# EAGLE design Dashboard rev4 (EAGLE 8.1.0)
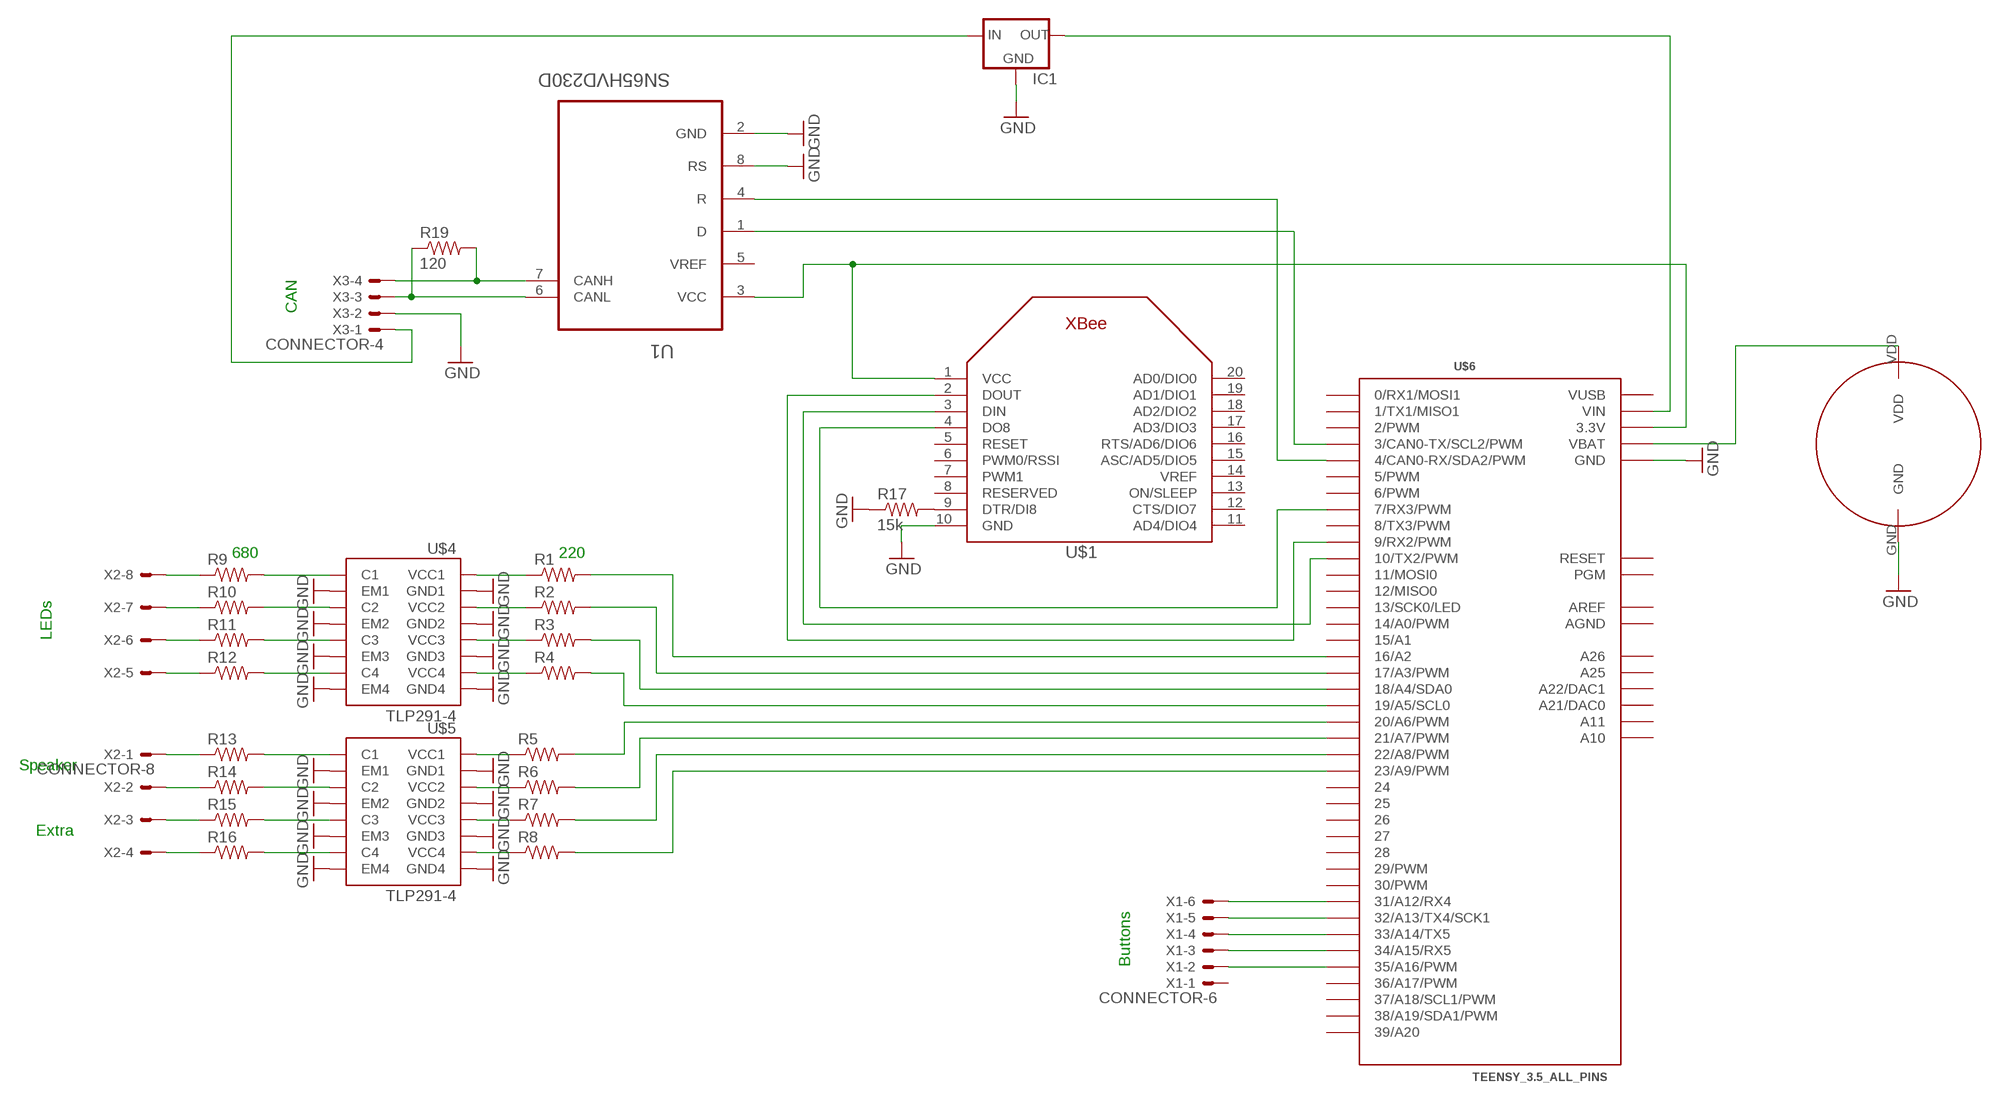
[diagram p0: schematic, sheet 1]

## Parts
IC1  5VREG_L7805SPACED  [TO-220-SPACED]
R1  RESISTORAXIAL-0.3  [AXIAL-0.3]
R2  RESISTORAXIAL-0.3  [AXIAL-0.3]
R3  RESISTORAXIAL-0.3  [AXIAL-0.3]
R4  RESISTORAXIAL-0.3  [AXIAL-0.3]
R5  RESISTORAXIAL-0.3  [AXIAL-0.3]
R6  RESISTORAXIAL-0.3  [AXIAL-0.3]
R7  RESISTORAXIAL-0.3  [AXIAL-0.3]
R8  RESISTORAXIAL-0.3  [AXIAL-0.3]
R9  RESISTORAXIAL-0.3  [AXIAL-0.3]
R10  RESISTORAXIAL-0.3  [AXIAL-0.3]
R11  RESISTORAXIAL-0.3  [AXIAL-0.3]
R12  RESISTORAXIAL-0.3  [AXIAL-0.3]
R13  RESISTORAXIAL-0.3  [AXIAL-0.3]
R14  RESISTORAXIAL-0.3  [AXIAL-0.3]
R15  RESISTORAXIAL-0.3  [AXIAL-0.3]
R16  RESISTORAXIAL-0.3  [AXIAL-0.3]
R17  15k  RESISTORAXIAL-0.3  [AXIAL-0.3]
R19  120  RESISTORAXIAL-0.3  [AXIAL-0.3]
U1  SN65HVD230D  [SOIC127P600X175-8N]
U$1  XBEE  [XBEE]
U$2  COIN-CELL-HOLDER  [COIN-CELL-HOLDER]
U$4  TLP291-4  [SOIC-16]
U$5  TLP291-4  [SOIC-16]
U$6  TEENSY_3.5_ALL_PINS  [TEENSY_3.5_ALL_PINS]
X1  CONNECTOR-6  [MINIFIT_5566-6]
X2  CONNECTOR-8  [MINIFIT_5566-8]
X3  CONNECTOR-4  [MINIFIT_5566-4]

## Nets
GND: IC1.2(GND) R17.P$1 U1.2(GND) U1.8(RS) U$1.10(GND) U$2.GND U$4.2(GND1) U$4.4(GND2) U$4.6(GND3) U$4.8(GND4) U$4.9(EM4) U$4.11(EM3) U$4.13(EM2) U$4.15(EM1) U$5.2(GND1) U$5.4(GND2) U$5.6(GND3) U$5.8(GND4) U$5.9(EM4) U$5.11(EM3) U$5.13(EM2) U$5.15(EM1) U$6.GND U$6.GND1(GND) U$6.GND3(GND) U$6.GND4(GND) U$6.GND6(GND) X3.2
N$1: R9.P$1 X2.8
N$2: U$1.2(DOUT) U$6.9(9/RX2/PWM)
N$3: R10.P$1 X2.7
N$4: R11.P$1 X2.6
N$5: R1.P$1 U$4.1(VCC1)
N$6: R12.P$1 X2.5
N$7: R2.P$1 U$4.3(VCC2)
N$8: R3.P$1 U$4.5(VCC3)
N$9: U$1.3(DIN) U$6.10(10/TX2/PWM)
N$10: U$1.4(DO8) U$6.7(7/RX3/PWM)
N$11: R4.P$1 U$4.7(VCC4)
N$12: R5.P$1 U$5.1(VCC1)
N$13: R17.P$2 U$1.9(DTR/DI8)
N$14: R6.P$1 U$5.3(VCC2)
N$15: R7.P$1 U$5.5(VCC3)
N$16: R8.P$1 U$5.7(VCC4)
N$17: U$6.31/A12(31/A12/RX4) X1.6
N$18: R13.P$1 X2.1
N$19: U$6.32/A13(32/A13/TX4/SCK1) X1.5
N$20: U$6.33/A14(33/A14/TX5) X1.4
N$21: U$6.34/A15(34/A15/RX5) X1.3
N$22: U$6.35/A16(35/A16/PWM) X1.2
N$23: U$2.VDD U$6.VBAT
N$24: U1.1(D) U$6.3(3/CAN0-TX/SCL2/PWM)
N$25: R9.P$2 U$4.16(C1)
N$26: R10.P$2 U$4.14(C2)
N$27: R11.P$2 U$4.12(C3)
N$28: R12.P$2 U$4.10(C4)
N$29: R13.P$2 U$5.16(C1)
N$30: R14.P$2 U$5.14(C2)
N$31: R15.P$2 U$5.12(C3)
N$32: R16.P$2 U$5.10(C4)
N$33: R14.P$1 X2.2
N$34: R15.P$1 X2.3
N$35: R16.P$1 X2.4
N$36: U1.4(R) U$6.4(4/CAN0-RX/SDA2/PWM)
N$37: R19.P$2 U1.7(CANH) X3.4
N$38: R1.P$2 U$6.16/A2
N$39: R2.P$2 U$6.17/A3(17/A3/PWM)
N$40: R3.P$2 U$6.18/A4(18/A4/SDA0)
N$41: R19.P$1 U1.6(CANL) X3.3
N$42: IC1.3(OUT) U$6.VIN
N$43: IC1.1(IN) X3.1
N$48: R4.P$2 U$6.19/A5(19/A5/SCL0)
N$49: R5.P$2 U$6.20/A6(20/A6/PWM)
N$50: R6.P$2 U$6.21/A7(21/A7/PWM)
N$51: R7.P$2 U$6.22/A8(22/A8/PWM)
N$54: R8.P$2 U$6.23/A9(23/A9/PWM)
VCC: U1.3(VCC) U$1.1(VCC) U$6.3.3V U$6.3.3V3(3.3V) U$6.3.3V4(3.3V)
Unconnected: U1.5(VREF) U$1.5(RESET) U$1.6(PWM0/RSSI) U$1.7(PWM1) U$1.8(RESERVED) U$1.11(AD4/DIO4) U$1.12(CTS/DIO7) U$1.13(ON/SLEEP) U$1.14(VREF) U$1.15(ASC/AD5/DIO5) U$1.16(RTS/AD6/DIO6) U$1.17(AD3/DIO3) U$1.18(AD2/DIO2) U$1.19(AD1/DIO1) U$1.20(AD0/DIO0) U$6.0(0/RX1/MOSI1) U$6.1(1/TX1/MISO1) U$6.2(2/PWM) U$6.5(5/PWM) U$6.6(6/PWM) U$6.8(8/TX3/PWM) U$6.11(11/MOSI0) U$6.12(12/MISO0) U$6.13(13/SCK0/LED) U$6.14/A0(14/A0/PWM) U$6.15/A1 U$6.24 U$6.25 U$6.26 U$6.27 U$6.28 U$6.29(29/PWM) U$6.30(30/PWM) U$6.36/A17(36/A17/PWM) U$6.37/A18(37/A18/SCL1/PWM) U$6.38/A19(38/A19/SDA1/PWM) U$6.39/A20 U$6.A10 U$6.A11 U$6.A21(A21/DAC0) U$6.A22(A22/DAC1) U$6.A25 U$6.A26 U$6.PGM U$6.RESET X1.1

## Notes on the sheet
- CAN
- 680 | 220
- LEDs
- Speaker
- Extra
- Buttons

## Power pins joined to a net without a drawn wire
AGND: U$6.AGND
AREF: U$6.AREF
VUSB: U$6.VUSB

## Library data of the parts
IC1 = HyTechDevices2:5VREG_L7805: Voltage Regulator Switching 5v regulator Datasheet <http://power.murata.com/data/power/oki-78sr.pdf> Standard 7805 5V regulator. IGO (Input Ground Output). Spark Fun Electronics SKU : COM-00107 Datasheet <http://www.mouser.com/ds/2/308/MC7800-D-94905.pdf>
R1-R17 R19 = HyTechDevices:RESISTOR: Resistor Basic schematic elements and footprints for 0603, 1206, and PTH resistors.
U1 = Texas Instruments:SN65HVD230D: 3.3-V CAN TRANSCEIVERS; MPN: SN65HVD230D; OC_FARNELL: 1103105; OC_NEWARK: 75C7744; PACKAGE: SOIC-8; SUPPLIER: Texas Instruments
U$1 = HyTechDevices:XBEE: Source: Adafruit <https://github.com/adafruit/Adafruit-Eagle-Library>
U$2 = HyTechDevices2:COIN-CELL-HOLDER
U$4 U$5 = HyTechDevices:TLP291-4: Toshiba Quad Channel Optocoupler TLP291-4
U$6 = Teensy_3_and_LC_Series_Boards_v1.4:TEENSY_3.5_ALL_PINS: All PIN version of the Teensy 3.5. Note: the NC pin is not shown in symbol package, not connected here either.
X1 = HyTechDevices2:CONNECTOR-6: Mini-Fit Junior connector 6 pole Source: http://www.molex.com; MPN: 95566-61002; OC_FARNELL: unknown; OC_NEWARK: 22K8620
X2 = HyTechDevices2:CONNECTOR-8: Mini-Fit Junior connector 8 pole Source: http://www.molex.com; OC_FARNELL: unknown; OC_NEWARK: unknown
X3 = HyTechDevices2:CONNECTOR-4: Mini-Fit Junior connector 4 pole Source: http://www.molex.com; OC_FARNELL: unknown; OC_NEWARK: unknown

## Board
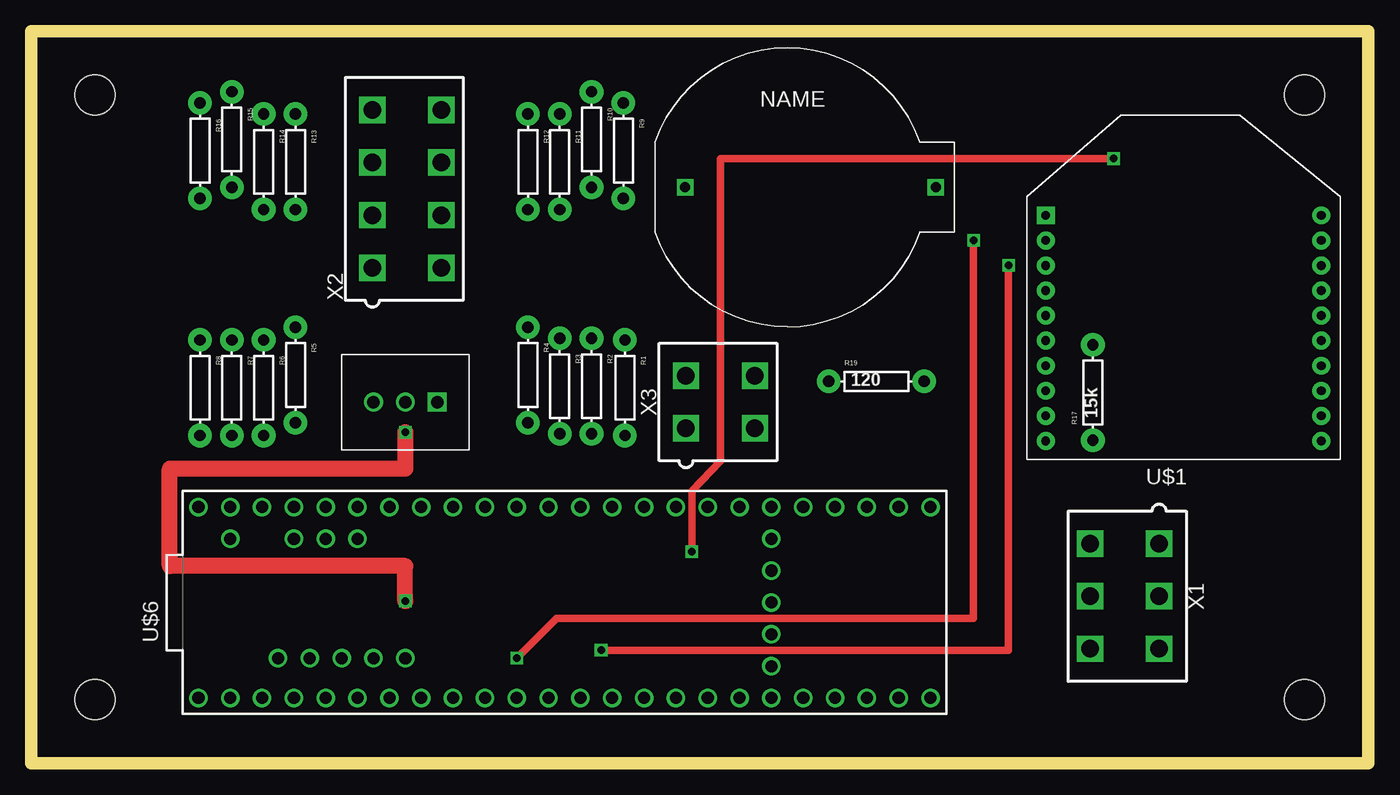
[diagram p1: board, top side]
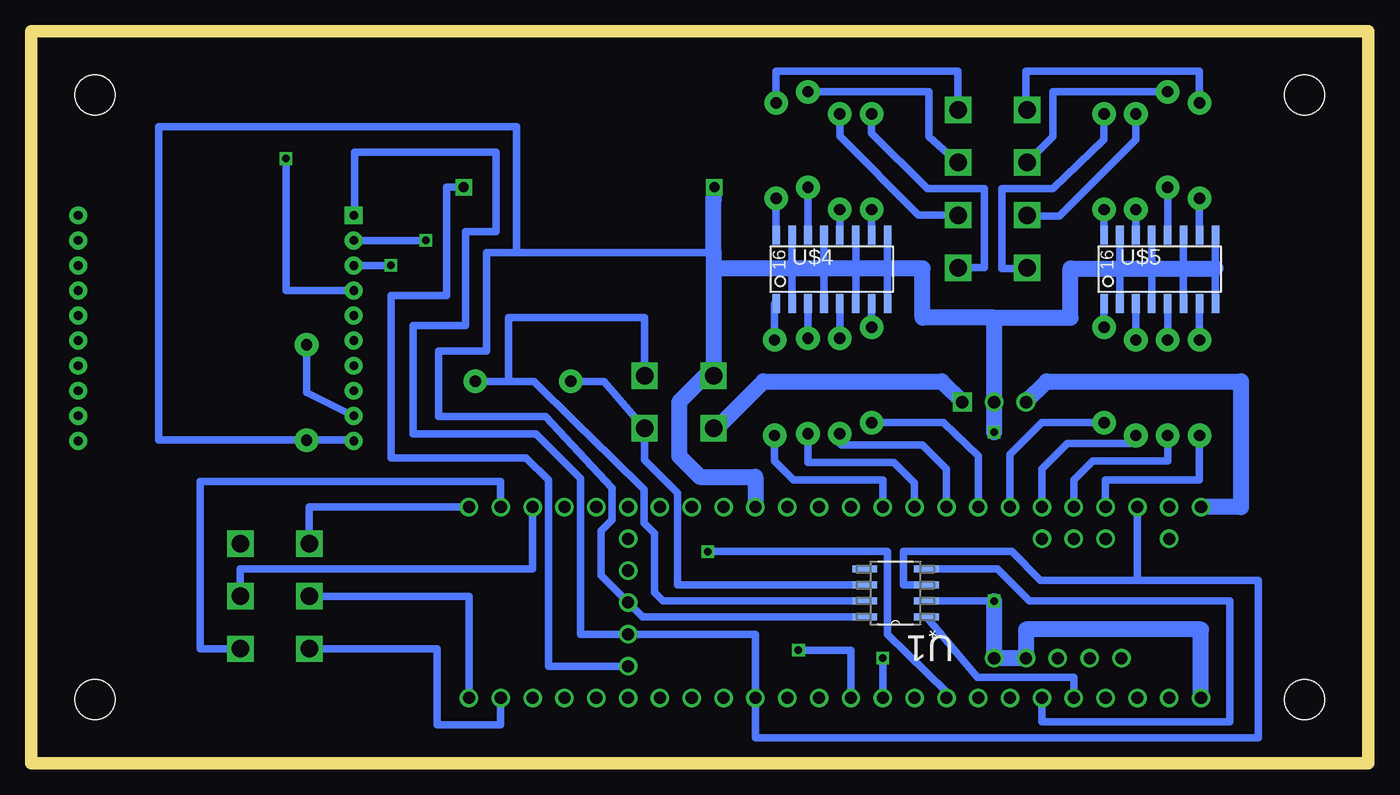
[diagram p2: board, bottom side, seen from below]

Size 106.68 x 58.42 mm. Coordinates in mm from the lower left corner, seen from the top.
Outline: 0,0 0,58.42 106.68,58.42 106.68,0 0,0
Copper layers (1*16): Top 0.035mm / dielectric 1.5mm / Bottom 0.035mm
Design rules "default *": minimum track width 10mil, minimum drill 24mil, track to track 16mil, track to pad 16mil, pad to pad 16mil, via to via 16mil, smd to smd 16mil, copper to edge 40mil, drill to drill 8mil, minimum pad ring 10mil, minimum via ring 8mil, stop-mask expansion 4mil, vias tented up to drill 0mil, thermal gap 10mil
Holes 3.2 mm at 5.08,53.34 5.08,5.08 101.6,5.08 101.6,53.34

### Footprints (pad centres in the part's own frame; a part is rotated, then mirrored left to right if it is on the bottom)
TO-220-SPACED = drill 1 square: 1 -2.54,0 | drill 1: 2 0,0; 3 2.54,0
AXIAL-0.3 = drill 0.9 pad 1.88: P$1 -3.81,0; P$2 3.81,0
SOIC127P600X175-8N = smd 1.981 x 0.559: 1 -2.464,1.905; 2 -2.464,0.635; 3 -2.464,-0.635; 4 -2.464,-1.905; 5 2.464,-1.905; 6 2.464,-0.635; 7 2.464,0.635; 8 2.464,1.905
XBEE = drill 0.7 pad 1.422 square: 1 -11,5.5 | drill 0.7 pad 1.422: 2 -11,3.5; 3 -11,1.5; 4 -11,-0.5; 5 -11,-2.5; 6 -11,-4.5; 7 -11,-6.5; 8 -11,-8.5; 9 -11,-10.5; 10 -11,-12.5; 11 11,-12.5; 12 11,-10.5; 13 11,-8.5; 14 11,-6.5; 15 11,-4.5; 16 11,-2.5; 17 11,-0.5; 18 11,1.5; 19 11,3.5; 20 11,5.5
COIN-CELL-HOLDER = drill 0.8 square: GND -8.15,0; VDD 11.85,0
SOIC-16 = smd 0.61 x 1.524: 1 -4.445,-2.794; 2 -3.175,-2.794; 3 -1.905,-2.794; 4 -0.635,-2.794; 5 0.635,-2.794; 6 1.905,-2.794; 7 3.175,-2.794; 8 4.445,-2.794; 9 4.445,2.667; 10 3.175,2.667; 11 1.905,2.667; 12 0.635,2.667; 13 -0.635,2.667; 14 -1.905,2.667; 15 -3.175,2.667; 16 -4.445,2.667
TEENSY_3.5_ALL_PINS = drill 0.965: 0 -7.62,27.94; 1 -7.62,25.4; 2 -7.62,22.86; 3 -7.62,20.32; 3.3V 7.62,25.4; 3.3V3 -7.62,-5.08; 3.3V4 -2.54,-15.24; 4 -7.62,17.78; 5 -7.62,15.24; 6 -7.62,12.7; 7 -7.62,10.16; 8 -7.62,7.62; 9 -7.62,5.08; 10 -7.62,2.54; 11 -7.62,0; 12 -7.62,-2.54; 13 7.62,-2.54; 14/A0 7.62,0; 15/A1 7.62,2.54; 16/A2 7.62,5.08; 17/A3 7.62,7.62; 18/A4 7.62,10.16; 19/A5 7.62,12.7; 20/A6 7.62,15.24; 21/A7 7.62,17.78; 22/A8 7.62,20.32; 23/A9 7.62,22.86; 24 -7.62,-7.62; 25 -7.62,-10.16; 26 -7.62,-12.7; 27 -7.62,-15.24; 28 -7.62,-17.78; 29 -7.62,-20.32; 30 -7.62,-22.86; 31/A12 -7.62,-25.4; 32/A13 -7.62,-27.94; 33/A14 7.62,-27.94; 34/A15 7.62,-25.4; 35/A16 7.62,-22.86; 36/A17 7.62,-20.32; 37/A18 7.62,-17.78; 38/A19 7.62,-15.24; 39/A20 7.62,-12.7; A10 5.08,20.32; A11 5.08,17.78; A21 7.62,-10.16; A22 7.62,-7.62; A25 -4.445,19.05; A26 -4.445,21.59; AGND 7.62,27.94; AREF 5.08,22.86; GND -7.62,30.48; GND1 7.62,-5.08; GND3 -4.445,16.51; GND4 -4.445,13.97; GND6 0,-15.24; NC -4.445,24.13; PGM 2.54,-15.24; RESET 5.08,-15.24; VBAT -5.08,-15.24; VIN 7.62,30.48; VUSB 5.08,27.94
MINIFIT_5566-6 = drill 1.4 square: 1 4.2,-2.75; 2 0,-2.75; 3 -4.2,-2.75; 4 4.2,2.75; 5 0,2.75; 6 -4.2,2.75
MINIFIT_5566-8 = drill 1.4 square: 1 6.3,-2.75; 2 2.1,-2.75; 3 -2.1,-2.75; 4 -6.3,-2.75; 5 6.3,2.75; 6 2.1,2.75; 7 -2.1,2.75; 8 -6.3,2.75
MINIFIT_5566-4 = drill 1.4 square: 1 2.1,-2.75; 2 -2.1,-2.75; 3 2.1,2.75; 4 -2.1,2.75

### Placement (x,y rotation side)
IC1  29.84,28.83 180 top
R1  47.37,29.97 270 top
R2  44.7,30.1 270 top
R3  42.16,30.1 270 top
R4  39.62,30.99 270 top
R5  21.08,30.99 270 top
R6  18.54,29.97 270 top
R7  16,29.97 270 top
R8  13.46,29.97 270 top
R9  47.24,48.9 270 top
R10  44.7,49.78 270 top
R11  42.16,48.01 270 top
R12  39.62,48.01 270 top
R13  21.08,48.01 270 top
R14  18.54,48.01 270 top
R15  16,49.78 270 top
R16  13.46,48.9 270 top
R17  84.71,29.59 90 top
R19  67.44,30.48 0 top
U1  37.72,13.59 180 bottom
U$1  91.95,38.23 0 top
U$2  60.33,45.97 0 top
U$4  42.8,39.5 0 bottom
U$5  16.64,39.5 0 bottom
U$6  43.81,12.83 90 top
X1  87.25,13.34 90 top
X2  29.97,45.85 270 top
X3  54.99,28.83 270 top

### Tracks (layer width: path | path; a pad name or v marks a point on that pad's centre or on a via)
GND  (via drill 0.6)
  Top 1.27: v29.84,26.42 29.84,23.5 11.05,23.5 11.05,15.75 29.84,15.75 v29.84,12.95
  Bottom 0.61: U$5.8 12.19,39.5 U$5.9 | U$5.11 14.73,39.5 U$5.6 | U$5.13 17.27,39.5 U$5.4 | U$5.15 19.81,39.5 U$5.2 | U$4.2 45.97,39.5 U$4.15 | U$4.6 40.89,39.5 U$4.11 | U$4.4 43.43,39.5 U$4.13 | U$1.10 80.95,25.78 R17.P$1 96.52,25.78 96.52,50.8 67.94,50.8 67.94,40.77 | v29.84,12.95 U1.2 | U$4.9 38.35,39.5 U$4.8 | U1.8 57.91,11.68 U$6.GND6 61.21,14.99 61.21,18.54 60.33,19.43 60.33,21.97 65.66,27.69 74.17,27.69 74.17,32.89 70.36,32.89 70.36,40.77 67.94,40.77 | 67.94,40.77 52.24,40.77
  Bottom 1.27: U$6.GND 13.34,10.67 27.3,10.67 U$6.GND3 U$6.GND4 v29.84,12.95 | v29.84,26.42 IC1.2 29.84,35.56 | 29.84,35.56 35.56,35.56 35.56,39.5 38.35,39.5 40.89,39.5 43.43,39.5 45.97,39.5 52.24,39.5 | 29.84,35.56 23.75,35.56 23.75,39.5 19.81,39.5 17.27,39.5 14.73,39.5 12.19,39.5 | U$2.GND 52.24,44.96 52.24,40.77 X3.2 52.89,30.93 54.99,28.83 54.99,24.51 53.34,22.86 48.9,22.86 U$6.GND1
N$1
  Bottom 0.61: X2.8 32.72,55.24 47.24,55.24 R9.P$1
N$2  (via drill 0.6)
  Top 0.61: v75.18,41.73 75.18,11.56 41.91,11.56 v38.73,8.38
  Bottom 0.61: U$1.2 v75.18,41.73 | U$6.9 v38.73,8.38
N$3
  Bottom 0.61: R10.P$1 35.05,53.59 35.05,50.02 X2.7
N$4
  Bottom 0.61: X2.6 35.87,43.75 42.16,50.04 R11.P$1
N$5
  Bottom 0.61: U$4.1 47.37,36.7 R1.P$1
N$6
  Bottom 0.61: X2.5 30.61,39.55 30.61,45.85 35.18,45.85 39.62,50.29 R12.P$1
N$7
  Bottom 0.61: U$4.3 R2.P$1
N$8
  Bottom 0.61: U$4.5 R3.P$1
N$9  (via drill 0.6)
  Top 0.61: 77.98,9.02 77.98,10.16 | 77.98,10.16 v77.98,39.73 | 77.98,10.16 77.98,9.02 | 77.98,9.02 v45.47,9.02
  Bottom 0.61: U$6.10 41.27,9.02 v45.47,9.02 | U$1.3 v77.98,39.73
N$10  (via drill 0.6)
  Top 0.61: v52.7,16.89 52.7,21.72 54.99,24.13 54.99,48.26 v86.36,48.26
  Bottom 0.61: U$6.7 33.66,5.71 38.35,10.29 38.35,16.89 v52.7,16.89 | U$1.4 86.36,37.73 v86.36,48.26
N$11
  Bottom 0.61: U$4.7 R4.P$1
N$12
  Bottom 0.61: U$5.1 R5.P$1
N$13
  Bottom 0.61: U$1.9 84.71,29.58 R17.P$2
N$14
  Bottom 0.61: U$5.3 R6.P$1
N$15
  Bottom 0.61: U$5.5 R7.P$1
N$16
  Bottom 0.61: U$5.7 R8.P$1
N$17
  Bottom 0.61: U$6.31/A12 69.22,3.05 74.3,3.05 74.3,9.13 X1.6
N$18
  Bottom 0.61: R13.P$1 21.08,49.78 25.15,45.85 29.21,45.85 29.21,39.5 27.22,39.5 X2.1
N$19
  Bottom 0.61: U$6.32/A13 71.75,13.34 X1.5
N$20
  Bottom 0.61: U$6.33/A14 84.5,20.45 X1.4
N$21
  Bottom 0.61: U$6.34/A15 69.22,22.48 93.22,22.48 93.22,9.13 X1.3
N$22
  Bottom 0.61: X1.2 90,15.49 66.67,15.49 U$6.35/A16
N$23
  Bottom 0.61: U$6.VBAT 65.41,7.75 65.41,22.61 67.18,24.38 77.98,24.38 77.98,37.34 73.53,37.34 73.53,45.97 U$2.VDD
N$24
  Bottom 0.61: U$6.3 23.5,6.86 31.19,6.86 U1.1 35.18,11.68
N$25
  Bottom 0.61: R9.P$2 U$4.16
N$26
  Bottom 0.61: R10.P$2 U$4.14
N$27
  Bottom 0.61: R11.P$2 U$4.12
N$28
  Bottom 0.61: R12.P$2 U$4.10
N$29
  Bottom 0.61: R13.P$2 U$5.16
N$30
  Bottom 0.61: R14.P$2 U$5.14
N$31
  Bottom 0.61: R15.P$2 U$5.12
N$32
  Bottom 0.61: R16.P$2 U$5.10
N$33
  Bottom 0.61: R14.P$1 18.54,49.78 24.64,43.69 27.16,43.69 X2.2
N$34
  Bottom 0.61: R15.P$1 25.15,53.59 25.15,50.02 X2.3
N$35
  Bottom 0.61: X2.4 27.3,52.15 27.3,55.24 13.46,55.24 R16.P$1
N$36
  Bottom 0.61: U$6.4 26.04,3.3 11.05,3.3 11.05,12.95 27.05,12.95 29.59,15.49 U1.4
N$37
  Bottom 0.61: U1.7 56.26,12.95 56.96,13.65 56.96,18.35 57.78,19.18 57.78,21.84 60.33,24.38 63.25,27.18 66.55,30.48 68.58,30.48 | X3.4 57.74,35.56 68.58,35.56 68.58,33.02 | 68.58,33.02 68.58,32.64 | 68.58,30.48 R19.P$2 | 68.58,33.02 68.58,30.48
N$38
  Bottom 0.61: U$6.16/A2 38.73,22.61 45.85,22.61 47.37,24.13 R1.P$2
N$39
  Bottom 0.61: R2.P$2 44.7,24 37.85,24 36.2,22.35 U$6.17/A3
N$40
  Bottom 0.61: R3.P$2 42.16,25.53 42.04,25.4 35.56,25.4 33.66,23.5 U$6.18/A4
N$41
  Bottom 0.61: 57.74,26.67 X3.3 | 57.78,26.73 X3.3 | X3.3 57.74,24.21 55.12,21.59 55.12,14.22 U1.6 | X3.3 60.96,30.48 R19.P$1
N$42
  Bottom 1.27: IC1.3 25.65,30.48 10.16,30.48 10.16,20.45 U$6.VIN
N$43
  Bottom 1.27: X3.1 52.01,26.73 48.26,30.48 34.04,30.48 IC1.1
N$48
  Bottom 0.61: U$6.19/A5 31.11,24.51 33.91,27.18 R4.P$2
N$49
  Bottom 0.61: R5.P$2 26.04,27.18 28.57,24.64 U$6.20/A6
N$50
  Bottom 0.61: R6.P$2 18.54,25.53 24,25.53 26.04,23.5 U$6.21/A7
N$51
  Bottom 0.61: R7.P$2 16,24.13 21.97,24.13 23.5,22.61 U$6.22/A8
N$54
  Bottom 0.61: R8.P$2 13.46,22.61 20.95,22.61 U$6.23/A9
VCC
  Bottom 0.61: U1.3 37.08,14.22 37.08,16.89 28.45,16.89 26.16,14.61 18.41,14.61 | 18.41,14.61 8.76,14.61 8.76,2.03 48.9,2.03 U$6.3.3V3 48.9,10.29 U$6.3.3V4 62.87,10.29 62.87,22.73 66.42,26.29 76.2,26.29 76.2,34.92 72.01,34.92 72.01,42.42 69.6,42.42 69.6,48.77 80.9,48.77 80.9,43.73 U$1.1 | 18.41,14.61 U$6.3.3V